# Altium project BIN_DETECTOR_V2.PrjPcb
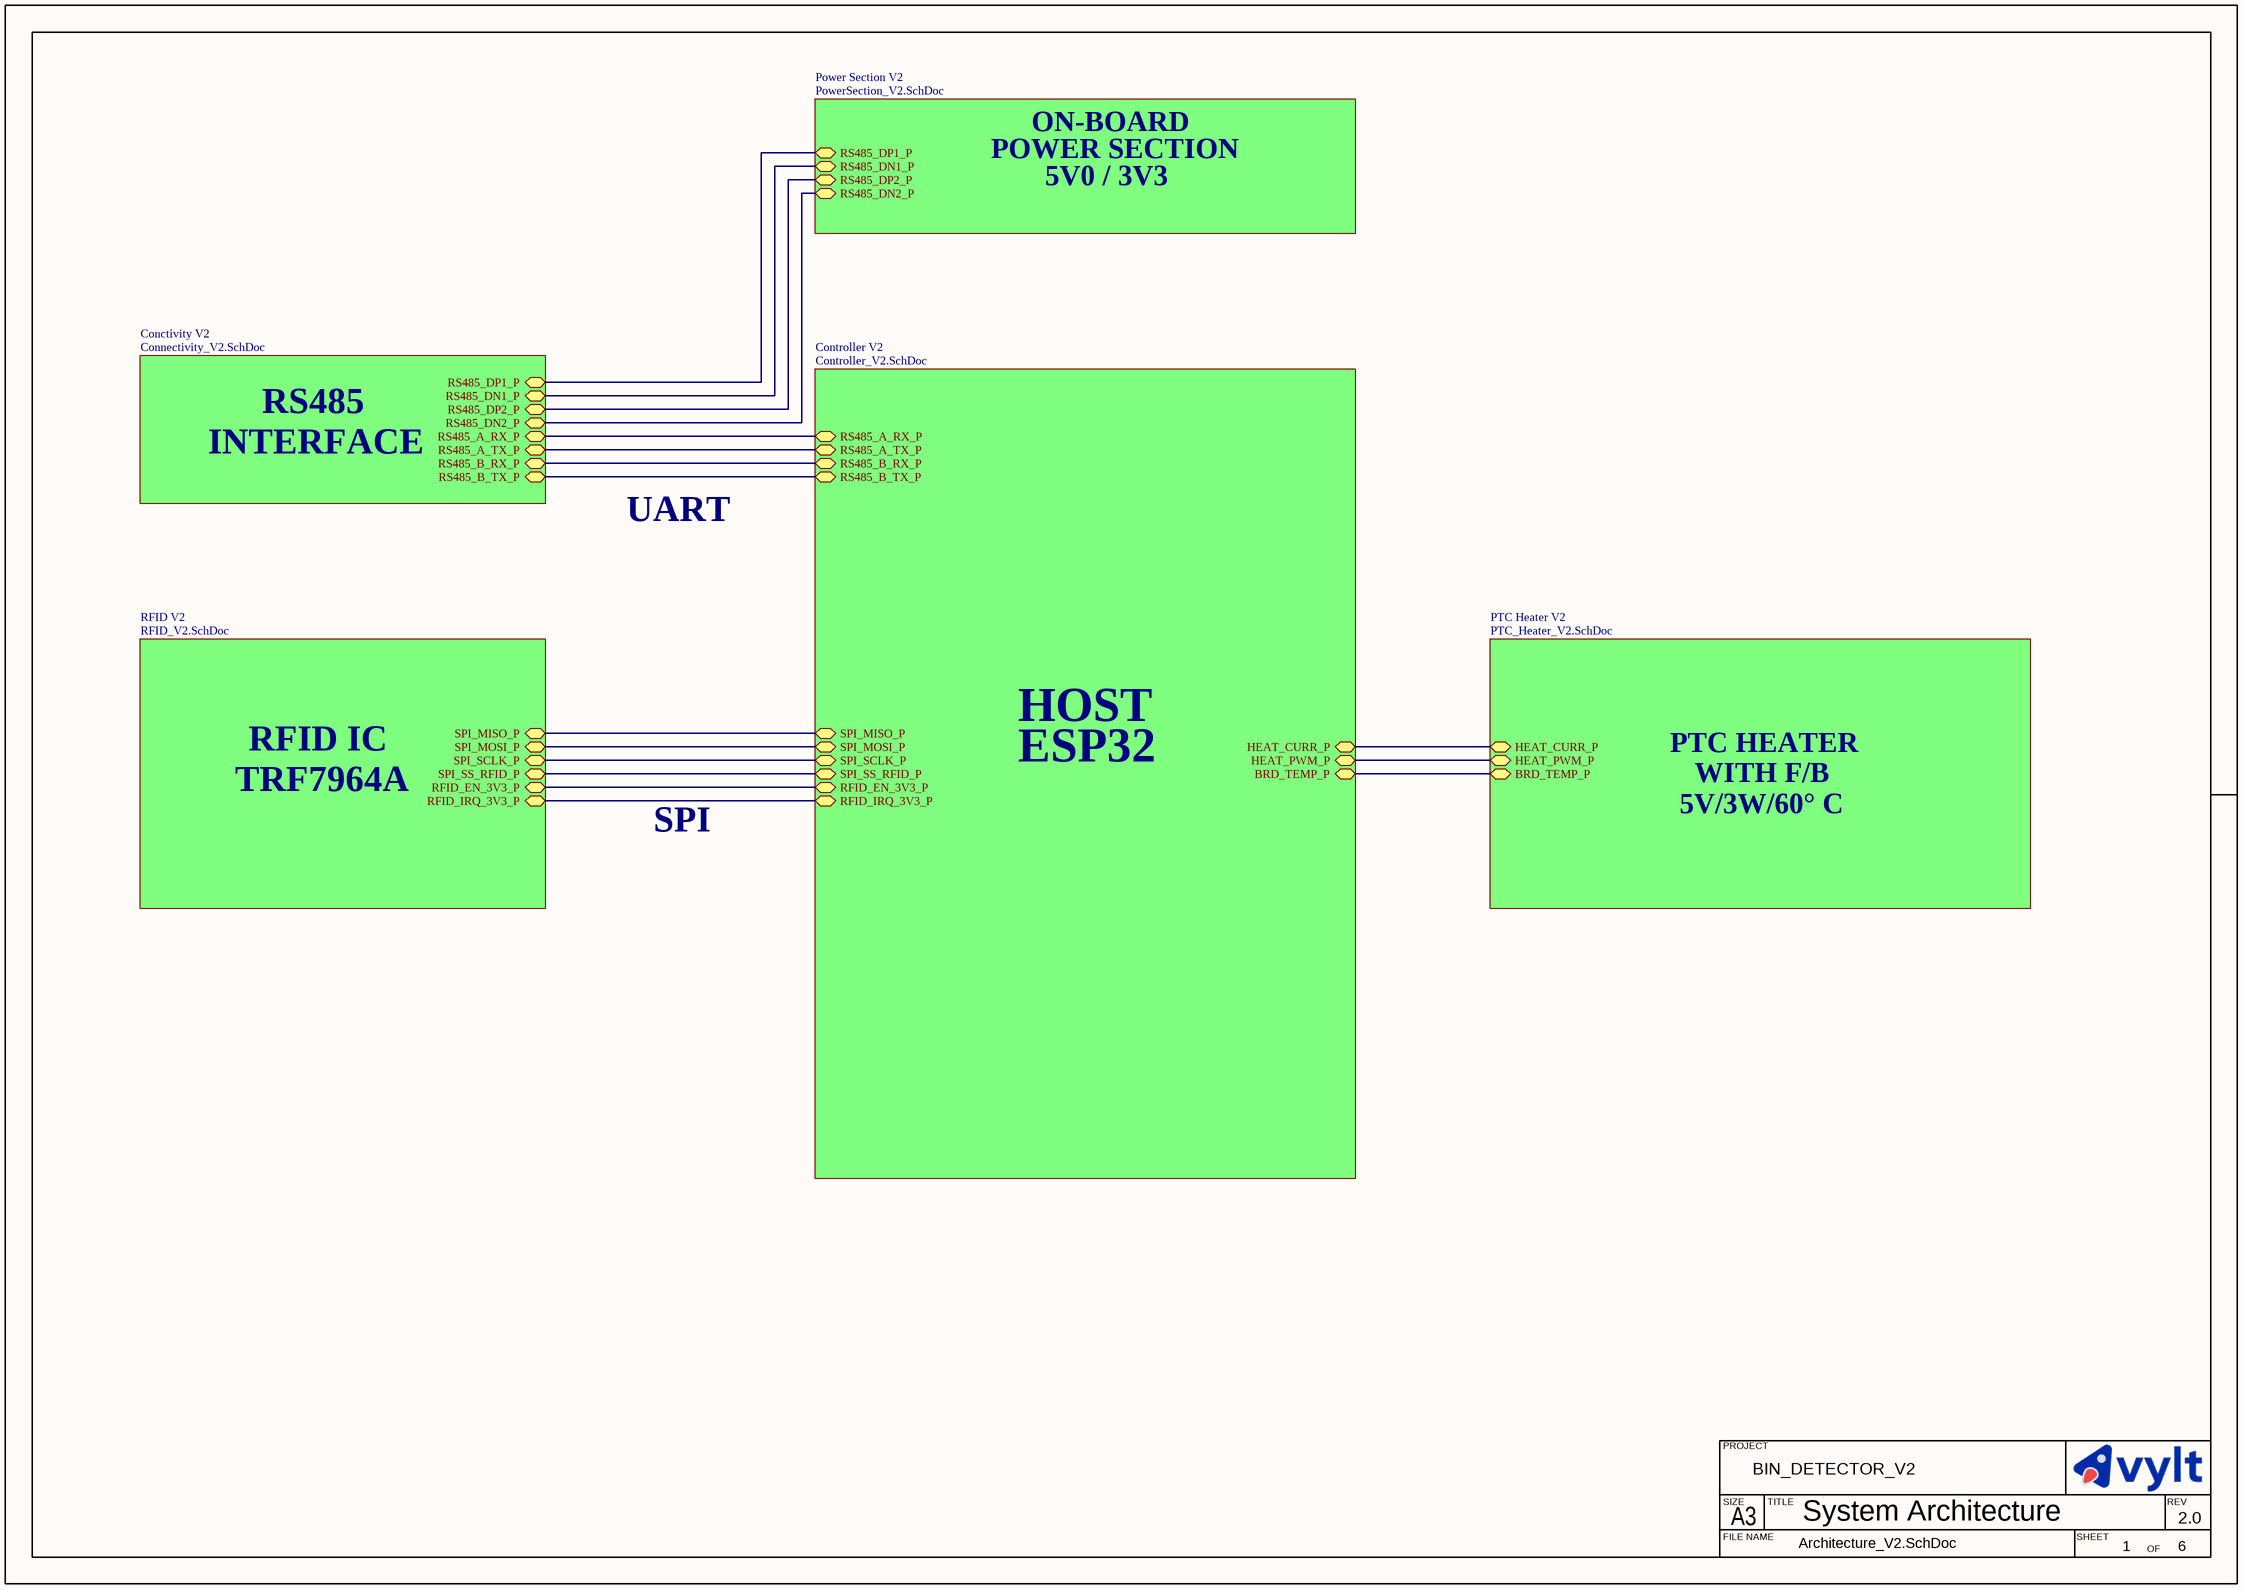
[diagram p0: Architecture_V2.SchDoc]
Revision: 2.0; Project: BIN_DETECTOR_V2
6 sheets, 119 parts. Net scope: hierarchical (ports join the sheet entries above them; power ports are global).
Board file: BIN_DETECTOR_V2.PcbDoc
Sheets:
  Architecture_V2.SchDoc
    RFID V2 = RFID_V2.SchDoc
    Controller V2 = Controller_V2.SchDoc
    Conctivity V2 = Connectivity_V2.SchDoc
    Power Section V2 = PowerSection_V2.SchDoc
    PTC Heater V2 = PTC_Heater_V2.SchDoc

## Sheet Architecture_V2.SchDoc: System Architecture
size 420 x 297 mm; SheetNumber: 1; SheetTotal: 6; DOC_NO_SCH_DWG: 1

### Sub-sheets
Conctivity V2 = Connectivity_V2.SchDoc: RS485_A_TX_P (bidir), RS485_A_RX_P (bidir), RS485_DP1_P (bidir), RS485_DN1_P (bidir), RS485_B_TX_P (bidir), RS485_B_RX_P (bidir), RS485_DP2_P (bidir), RS485_DN2_P (bidir)
Controller V2 = Controller_V2.SchDoc: SPI_MOSI_P (bidir), SPI_SCLK_P (bidir), SPI_SS_RFID_P (bidir), RFID_EN_3V3_P (bidir), RFID_IRQ_3V3_P (bidir), RS485_A_TX_P (bidir), RS485_A_RX_P (bidir), SPI_MISO_P (bidir), HEAT_CURR_P (bidir), BRD_TEMP_P (bidir), HEAT_PWM_P (bidir), RS485_B_TX_P (bidir), RS485_B_RX_P (bidir)
Power Section V2 = PowerSection_V2.SchDoc: RS485_DP1_P (bidir), RS485_DN1_P (bidir), RS485_DP2_P (bidir), RS485_DN2_P (bidir)
PTC Heater V2 = PTC_Heater_V2.SchDoc: HEAT_CURR_P (bidir), BRD_TEMP_P (bidir), HEAT_PWM_P (bidir)
RFID V2 = RFID_V2.SchDoc: SPI_MISO_P (bidir), SPI_MOSI_P (bidir), SPI_SCLK_P (bidir), SPI_SS_RFID_P (bidir), RFID_EN_3V3_P (bidir), RFID_IRQ_3V3_P (bidir)

### Nets
BRD_TEMP: sheet Controller V2/BRD_TEMP_P, sheet PTC Heater V2/BRD_TEMP_P
HEAT_CURR: sheet Controller V2/HEAT_CURR_P, sheet PTC Heater V2/HEAT_CURR_P
HEAT_PWM: sheet Controller V2/HEAT_PWM_P, sheet PTC Heater V2/HEAT_PWM_P
RFID_3V3_EN: sheet RFID V2/RFID_EN_3V3_P, sheet Controller V2/RFID_EN_3V3_P
RFID_3V3_IRQ: sheet RFID V2/RFID_IRQ_3V3_P, sheet Controller V2/RFID_IRQ_3V3_P
RFID_MISO: sheet RFID V2/SPI_MISO_P, sheet Controller V2/SPI_MISO_P
RFID_MOSI: sheet RFID V2/SPI_MOSI_P, sheet Controller V2/SPI_MOSI_P
RFID_SCLK: sheet RFID V2/SPI_SCLK_P, sheet Controller V2/SPI_SCLK_P
RFID_SS: sheet RFID V2/SPI_SS_RFID_P, sheet Controller V2/SPI_SS_RFID_P
RS485_A_RX: sheet Controller V2/RS485_A_RX_P, sheet Conctivity V2/RS485_A_RX_P
RS485_A_TX: sheet Controller V2/RS485_A_TX_P, sheet Conctivity V2/RS485_A_TX_P
RS485_B_RX: sheet Controller V2/RS485_B_RX_P, sheet Conctivity V2/RS485_B_RX_P
RS485_B_TX: sheet Controller V2/RS485_B_TX_P, sheet Conctivity V2/RS485_B_TX_P
RS485_L1_N: sheet Conctivity V2/RS485_DN1_P, sheet Power Section V2/RS485_DN1_P
RS485_L1_P: sheet Conctivity V2/RS485_DP1_P, sheet Power Section V2/RS485_DP1_P
RS485_L2_N: sheet Conctivity V2/RS485_DN2_P, sheet Power Section V2/RS485_DN2_P
RS485_L2_P: sheet Conctivity V2/RS485_DP2_P, sheet Power Section V2/RS485_DP2_P

### Notes on the sheet
- POWER SECTION
- ON-BOARD
- 5V0 / 3V3
- INTERFACE
- RS485
- UART
- HOST
- TRF7964A
- RFID IC
- ESP32
- PTC HEATER
- WITH F/B
- SPI
- 5V/3W/60° C
- PROJECT
- SIZE
- FILE NAME
- A3
- TITLE
- SHEET
- OF
- REV

## Sheet RFID_V2.SchDoc: RFID IC
size 420 x 297 mm; SheetNumber: 2; SheetTotal: 3
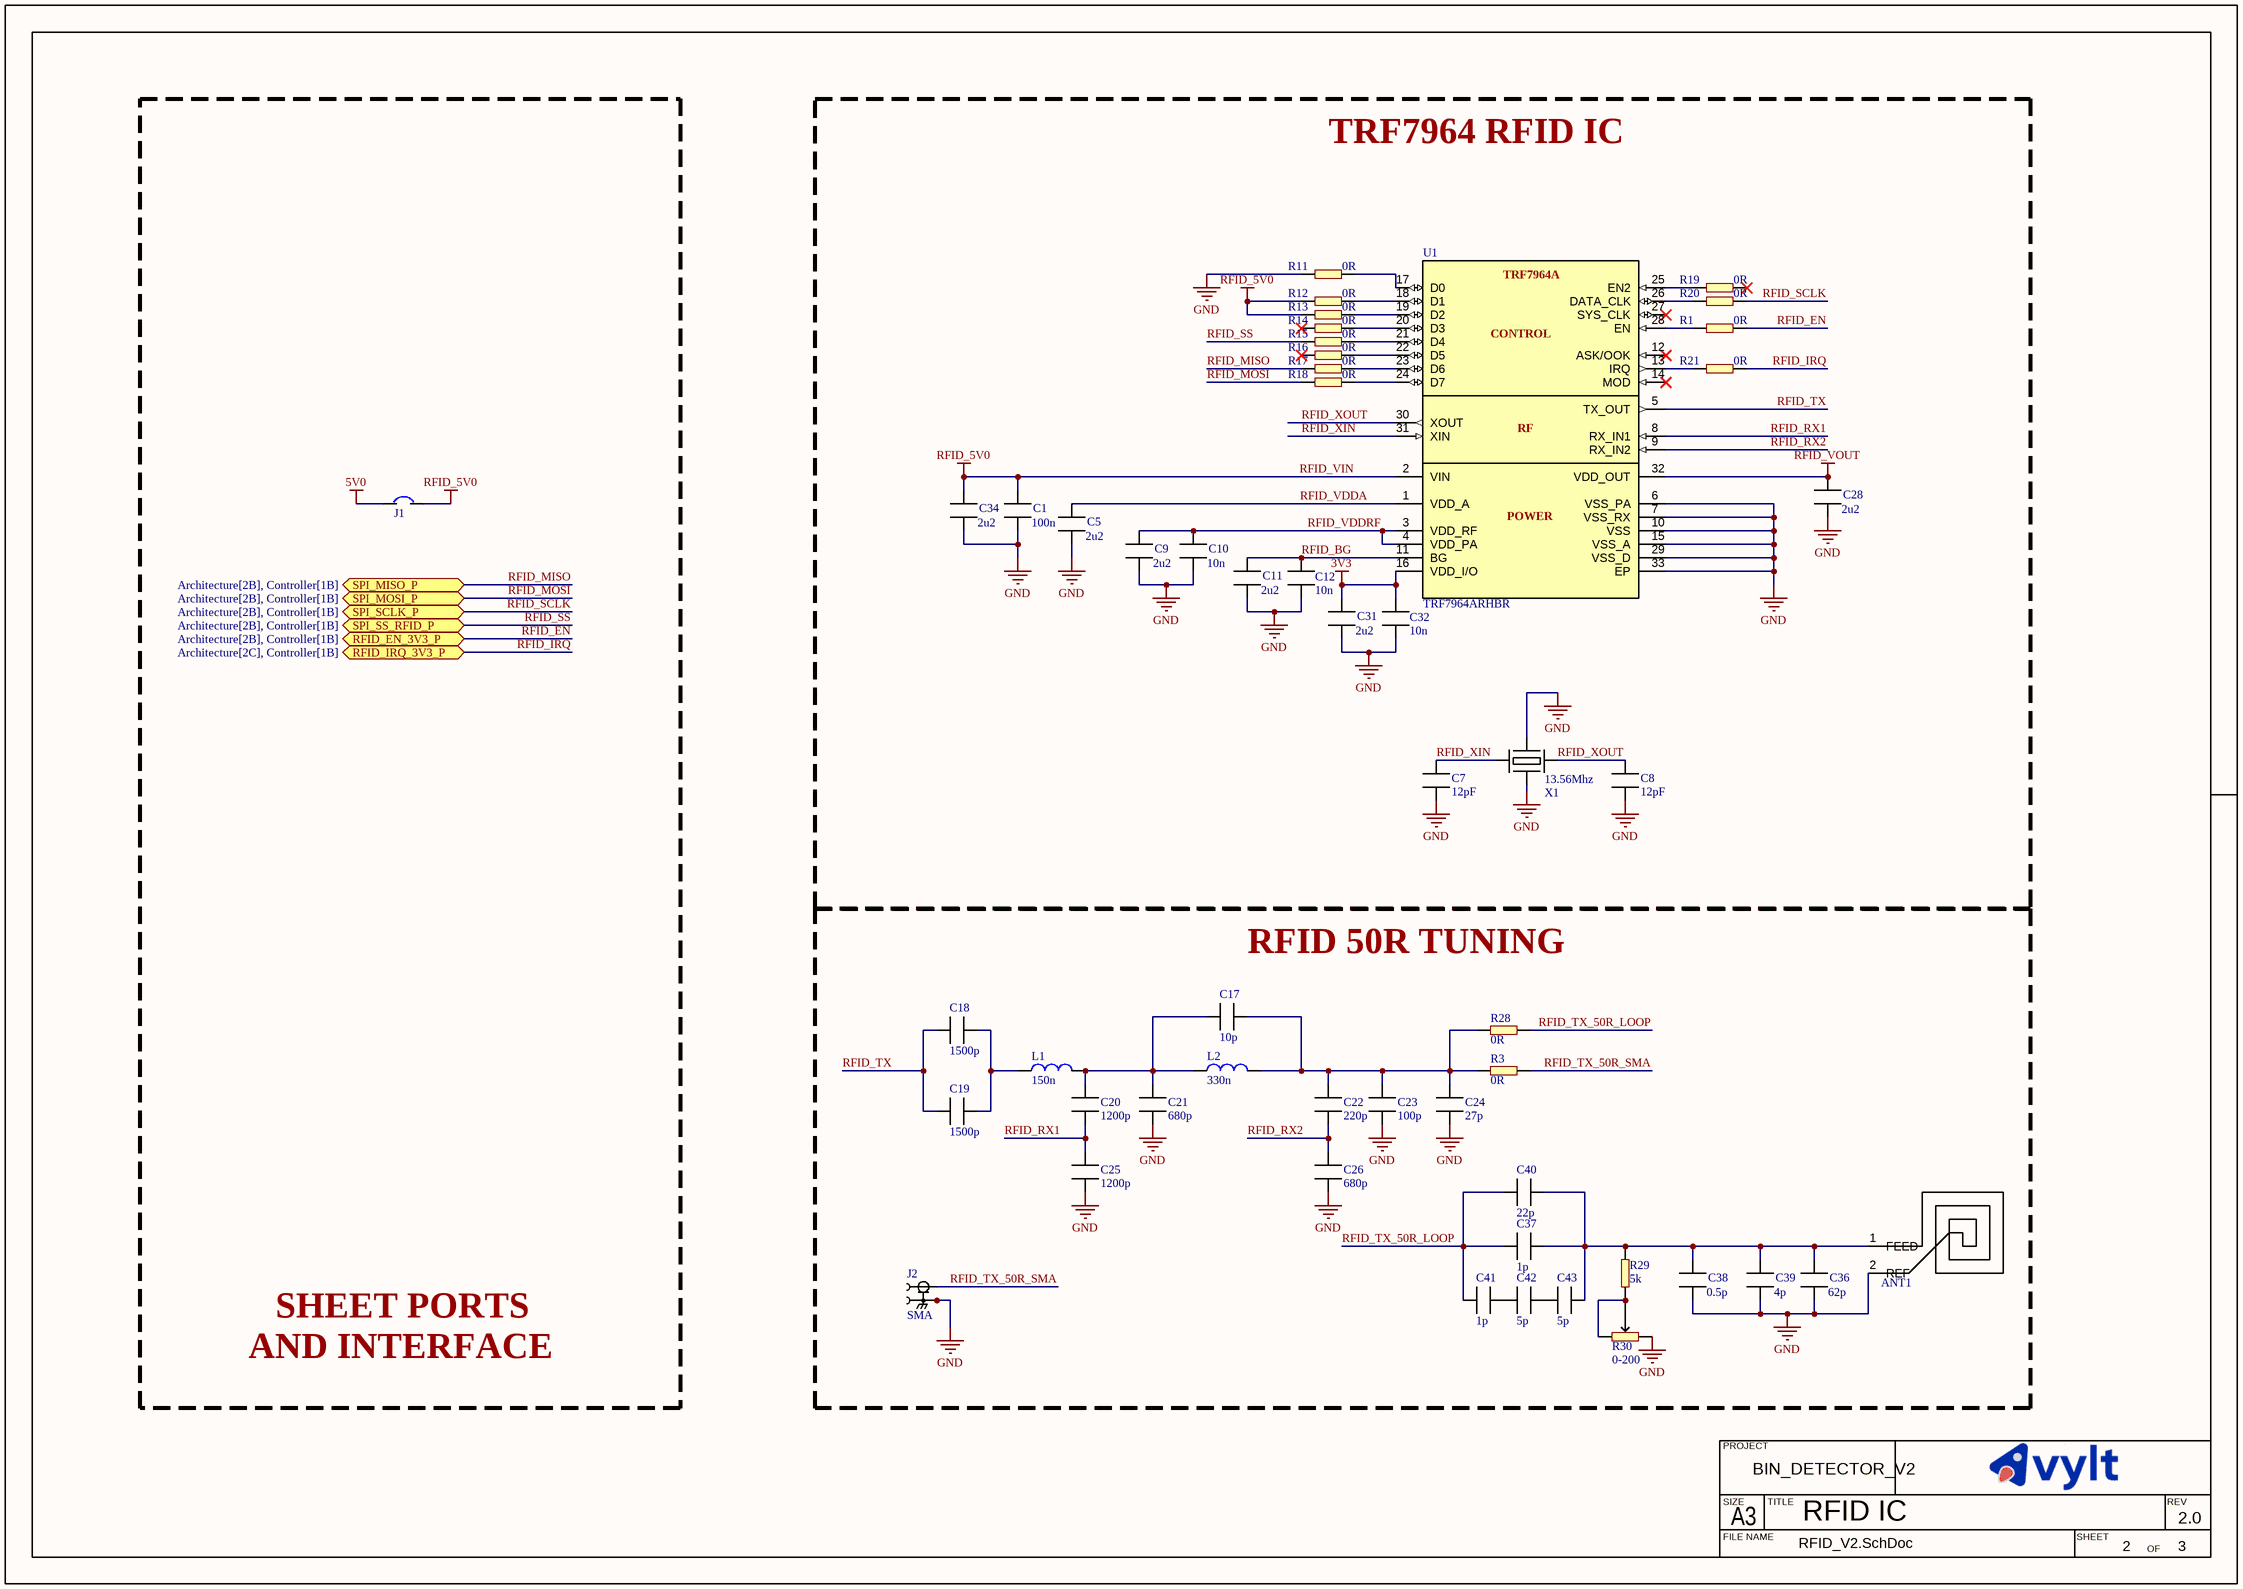
[diagram p1: RFID_V2.SchDoc]

### Parts
ANT1  LOOP_ANT_1.51uH  [LOOP_ANT_1.51uH]  (value not drawn)  (no BOM)
C1  value 100n  [CAPC1608X10N]  (hidden comment: ERP_102-1)
C5  value 2u2  [CAPC1608X10N]  (hidden comment: ERP_102-1)
C7  value 12pF  [CAPC1608X10N]  (hidden comment: ERP_102-1)
C8  value 12pF  [CAPC1608X10N]  (hidden comment: ERP_102-1)
C9  value 2u2  [CAPC1608X10N]  (hidden comment: ERP_102-1)
C10  value 10n  [CAPC1608X10N]  (hidden comment: ERP_102-1)
C11  value 2u2  [CAPC1608X10N]  (hidden comment: ERP_102-1)
C12  value 10n  [CAPC1608X10N]  (hidden comment: ERP_102-1)
C17  value 10p  [CAPC1608X10N]  (hidden comment: ERP_102-1)
C18  value 1500p  [CAPC1608X10N]  (hidden comment: ERP_102-1)
C19  value 1500p  [CAPC1608X10N]  (hidden comment: ERP_102-1)
C20  value 1200p  [CAPC1608X10N]  (hidden comment: ERP_102-1)
C21  value 680p  [CAPC1608X10N]  (hidden comment: ERP_102-1)
C22  value 220p  [CAPC1608X10N]  (hidden comment: ERP_102-1)
C23  value 100p  [CAPC1608X10N]  (hidden comment: ERP_102-1)
C24  value 27p  [CAPC1608X10N]  (hidden comment: ERP_102-1)
C25  value 1200p  [CAPC1608X10N]  (hidden comment: ERP_102-1)
C26  value 680p  [CAPC1608X10N]  (hidden comment: ERP_102-1)
C28  value 2u2  [CAPC1608X10N]  (hidden comment: ERP_102-1)
C31  value 2u2  [CAPC1608X10N]  (hidden comment: ERP_102-1)
C32  value 10n  [CAPC1608X10N]  (hidden comment: ERP_102-1)
C34  value 2u2  [CAPC1608X10N]  (hidden comment: ERP_102-1)
C36  value 62p  [CAPC1608X10N]  (hidden comment: ERP_102-1)
C37  value 1p  [CAPC1608X10N]  (hidden comment: ERP_102-1)
C38  value 0.5p  [CAPC1608X10N]  (hidden comment: ERP_102-1)
C39  value 4p  [CAPC1608X10N]  (hidden comment: ERP_102-1)
C40  value 22p  [CAPC1608X10N]  (hidden comment: ERP_102-1)
C41  value 1p  [CAPC1608X10N]  (hidden comment: ERP_102-1)
C42  value 5p  [CAPC1608X10N]  (hidden comment: ERP_102-1)
C43  value 5p  [CAPC1608X10N]  (hidden comment: ERP_102-1)
J1  Jumper_2P  [Jumper_2P]  (value not drawn)  (no BOM)
J2  value SMA  [SMA_TopEntry_50R]  (hidden comment: SMA_TopEntry_50R)
L1  value 150n  [IND_1008]  (hidden comment: ERP_103-3)
L2  value 330n  [IND_1008]  (hidden comment: ERP_103-3)
R1  value 0R  [RES_0603]  (hidden comment: ERP_101-1)
R3  value 0R  [RES_0603]  (hidden comment: ERP_101-1)
R11  value 0R  [RES_0603]  (hidden comment: ERP_101-1)
R12  value 0R  [RES_0603]  (hidden comment: ERP_101-1)
R13  value 0R  [RES_0603]  (hidden comment: ERP_101-1)
R14  value 0R  [RES_0603]  (hidden comment: ERP_101-1)
R15  value 0R  [RES_0603]  (hidden comment: ERP_101-1)
R16  value 0R  [RES_0603]  (hidden comment: ERP_101-1)
R17  value 0R  [RES_0603]  (hidden comment: ERP_101-1)
R18  value 0R  [RES_0603]  (hidden comment: ERP_101-1)
R19  value 0R  [RES_0603]  (hidden comment: ERP_101-1)
R20  value 0R  [RES_0603]  (hidden comment: ERP_101-1)
R21  value 0R  [RES_0603]  (hidden comment: ERP_101-1)
R28  value 0R  [RES_0603]  (hidden comment: ERP_101-1)
R29  value 5k  [RES_0603]  (hidden comment: ERP_101-1)
R30  value 0-200  [RES_VAR_3361P]  (hidden comment: ERP_101-1)
U1  value TRF7964ARHBR  [RHB32_3P45X3P45_TEX]  (hidden comment: ERP_121-4)
X1  value 13.56Mhz  [CRYS_L3.2_W2.5]  (hidden comment: ERP_111-1)

### Blocks framed on the sheet
TRF7964 RFID IC: C1 C5 C7-C12 C28 C31 C32 C34 R1 R11-R21 U1 X1
RFID 50R TUNING: ANT1 C17-C26 C36-C43 J2 L1 L2 R3 R28-R30

### Ports
RFID_EN_3V3_P (bidir, see Architecture[2B], Controller[1B]), RFID_IRQ_3V3_P (bidir, see Architecture[2C], Controller[1B]), SPI_MISO_P (bidir, see Architecture[2B], Controller[1B]), SPI_MOSI_P (bidir, see Architecture[2B], Controller[1B]), SPI_SCLK_P (bidir, see Architecture[2B], Controller[1B]), SPI_SS_RFID_P (bidir, see Architecture[2B], Controller[1B])

### Nets
3V3: C31.1 C32.1 U1.16(VDD_I/O)
5V0: J1.1  [project net HEAT_VSEN_P]
GND: ANT1.2(REF) C1.2 C5.2 C7.2 C8.2 C9.2 C10.2 C11.2 C12.2 C21.1 C23.1 C24.1 C25.1 C26.1 C28.2 C31.2 C32.2 C34.2 C36.2 C38.2 C39.2 J2.2 J2.3 J2.4 J2.5 R11.2 R30.1 U1.6(VSS_PA) U1.7(VSS_RX) U1.10(VSS) U1.15(VSS_A) U1.29(VSS_D) U1.33(EP) X1.2 X1.4
RFID_VIN: C1.1 C34.1 J1.2 R12.2 R13.2 U1.2(VIN)  [also labelled RFID_5V0]
RFID_VOUT: C28.1 U1.32(VDD_OUT)
RFID_BG: C11.1 C12.1 U1.11(BG)
RFID_EN: R1.1 ; port RFID_EN_3V3_P  [project net RFID_3V3_EN]
RFID_IRQ: R21.1 ; port RFID_IRQ_3V3_P  [project net RFID_3V3_IRQ]
RFID_MISO: R17.2 ; port SPI_MISO_P
RFID_MOSI: R18.2 ; port SPI_MOSI_P
RFID_RX1: C20.1 C25.2 U1.8(RX_IN1)
RFID_RX2: C22.1 C26.2 U1.9(RX_IN2)
RFID_SCLK: R20.1 ; port SPI_SCLK_P
RFID_SS: R15.2 ; port SPI_SS_RFID_P
RFID_TX: C18.1 C19.1 U1.5(TX_OUT)
RFID_TX_50R_LOOP: C37.1 C40.1 C41.1 R28.1
RFID_TX_50R_SMA: J2.1 R3.1
RFID_VDDA: C5.1 U1.1(VDD_A)
RFID_VDDRF: C9.1 C10.1 U1.3(VDD_RF) U1.4(VDD_PA)
RFID_XIN: C7.1 U1.31(XIN) X1.1
RFID_XOUT: C8.1 U1.30(XOUT) X1.3
NetANT1_1: ANT1.1(FEED) C36.1 C37.2 C38.1 C39.1 C40.2 C43.2 R29.2
NetC17_1: C17.1 C22.2 C23.2 C24.2 L2.2 R3.2 R28.2
NetC17_2: C17.2 C20.2 C21.2 L1.2 L2.1
NetC18_2: C18.2 C19.2 L1.1
NetC41_2: C41.2 C42.1
NetC42_2: C42.2 C43.1
NetR1_2: R1.2 U1.28(EN)
NetR11_1: R11.1 U1.17(D0)
NetR12_1: R12.1 U1.18(D1)
NetR13_1: R13.1 U1.19(D2)
NetR14_1: R14.1 U1.20(D3)
NetR15_1: R15.1 U1.21(D4)
NetR16_1: R16.1 U1.22(D5)
NetR17_1: R17.1 U1.23(D6)
NetR18_1: R18.1 U1.24(D7)
NetR19_2: R19.2 U1.25(EN2)
NetR20_2: R20.2 U1.26(DATA_CLK)
NetR21_2: R21.2 U1.13(IRQ)
NetR29_1: R29.1 R30.2 R30.3

Not connected (* = marked no-connect by the designer): R14 2*; R16 2*; R19 1*; U1 12(ASK/OOK)* 14(MOD)* 27(SYS_CLK)*

### Notes on the sheet
- SHEET PORTS
- AND INTERFACE
- PROJECT
- SIZE
- FILE NAME
- A3
- TITLE
- SHEET
- OF
- REV
- (in symbol TRF7964A) CONTROL; RF; POWER

### Library data of the parts
ANT1 = LOOP_ANT_1.51uH: LOOP_ANT_1.51uH_4t_40L_45W_0.4W_0.8P
C1 = MLCC_0603: MLCC 0603; Manufacturer 1: Murata; Manufacturer Part Number 1: CC0603JRX7R9BB104; Package: 0603; Supplier 1: *; Suuplier Part Number 1: *; ERP: *
C5 C9 C11 C28 C31 C34 = MLCC_0603: MLCC 0603; Manufacturer 1: Murata Electronics; Manufacturer Part Number 1: GRT188R61H225KE13D; Package: 0603; Suuplier Part Number 1: *; ERP: *; Supplier 1: Digikey; Supplier Part Number 1: 490-12332-1-ND
C7 C8 = MLCC_0603: MLCC 0603; Manufacturer 1: Yageo; Manufacturer Part Number 1: CC0603JPNPO9BN120; Package: 0603; Suuplier Part Number 1: *; ERP: *; Supplier 1: Digikey; Supplier Part Number 1: 13-CC0603JPNPO9BN120CT-ND
C10 C12 C32 = MLCC_0603: MLCC 0603; Manufacturer 1: Murata; Manufacturer Part Number 1: GRM1885C1H103JA01D; Package: 0603; Suuplier Part Number 1: *; ERP: *; Supplier 1: Digikey; Supplier Part Number 1: 490-9666-1-ND
C17 = MLCC_0603: MLCC 0603; Manufacturer 1: Yageo; Manufacturer Part Number 1: CC0603FRNPO9BN100; Package: 0603; Suuplier Part Number 1: *; ERP: *; Supplier 1: Digikey; Supplier Part Number 1: 311-3349-1-ND
C18 C19 = MLCC_0603: MLCC 0603; Manufacturer 1: Murata; Manufacturer Part Number 1: GRM1885C1H152FA01D; Package: 0603; Suuplier Part Number 1: *; ERP: *; Supplier 1: Digikey; Supplier Part Number 1: 490-11446-1-ND
C20 C25 = MLCC_0603: MLCC 0603; Manufacturer 1: Murata; Manufacturer Part Number 1: GCM1885C1H122FA16D; Package: 0603; Suuplier Part Number 1: *; ERP: *; Supplier 1: Digikey; Supplier Part Number 1: 490-GCM1885C1H122FA16DCT-ND
C21 C26 = MLCC_0603: MLCC 0603; Manufacturer 1: Yageo; Manufacturer Part Number 1: CC0603FRNPO9BN681; Package: 0603; Suuplier Part Number 1: *; ERP: *; Supplier 1: Digikey; Supplier Part Number 1: 311-3905-1-ND
C22 = MLCC_0603: MLCC 0603; Manufacturer 1: Yageo; Manufacturer Part Number 1: CC0603FRNPO9BN221; Package: 0603; Suuplier Part Number 1: *; ERP: *; Supplier 1: Digikey; Supplier Part Number 1: 311-3891-1-ND
C23 = MLCC_0603: MLCC 0603; Manufacturer 1: Yageo; Manufacturer Part Number 1: CC0603FRNPO9BN101; Package: 0603; Suuplier Part Number 1: *; ERP: *; Supplier 1: Digikey; Supplier Part Number 1: 311-3599-1-ND
C24 = MLCC_0603: MLCC 0603; Manufacturer 1: Yageo; Manufacturer Part Number 1: CC0603FRNPO9BN270; Package: 0603; Suuplier Part Number 1: *; ERP: *; Supplier 1: Digikey; Supplier Part Number 1: 311-3892-1-ND
C36 = MLCC_0603: Chip Capacitor, 2-Leads, Body 1.60x0.80mm, IPC Medium Density; Manufacturer 1: KEMET; Manufacturer Part Number 1: CBR06C620F5GAC; Package: 0603; Suuplier Part Number 1: *; ERP: *
C37 C41 = MLCC_0603: Chip Capacitor, 2-Leads, Body 1.60x0.80mm, IPC Medium Density; Manufacturer 1: KEMET; Manufacturer Part Number 1: CBR06C109B5GAC; Package: 0603; Suuplier Part Number 1: *; ERP: *; Supplier 1: Digikey; Supplier Part Number 1: 399-CBR06C109B5GACCT-ND
C38 = MLCC_0603: Chip Capacitor, 2-Leads, Body 1.60x0.80mm, IPC Medium Density; Manufacturer 1: KEMET; Manufacturer Part Number 1: CBR06C508B5GAC; Package: 0603; Suuplier Part Number 1: *; ERP: *; Supplier 1: Digikey; Supplier Part Number 1: 399-13249-1-ND
C39 = MLCC_0603: Chip Capacitor, 2-Leads, Body 1.60x0.80mm, IPC Medium Density; Manufacturer 1: KEMET; Manufacturer Part Number 1: CBR06C409B5GAC; Package: 0603; Suuplier Part Number 1: *; ERP: *; Supplier 1: Digikey; Supplier Part Number 1: 399-CBR06C409B5GACCT-ND
C40 = MLCC_0603: Chip Capacitor, 2-Leads, Body 1.60x0.80mm, IPC Medium Density; Manufacturer 1: KEMET; Manufacturer Part Number 1: CBR06C220J5GACAUTO; Package: 0603; Suuplier Part Number 1: *; ERP: *; Supplier 1: Digikey; Supplier Part Number 1: 399-CBR06C220J5GACAUTOCT-ND
C42 C43 = MLCC_0603: Chip Capacitor, 2-Leads, Body 1.60x0.80mm, IPC Medium Density; Manufacturer 1: KEMET; Manufacturer Part Number 1: CBR06C509A5GAC; Package: 0603; Suuplier Part Number 1: *; ERP: *; Supplier 1: Digikey; Supplier Part Number 1: 399-17323-1-ND
J1 = Jumper_2P: Jumper 2 Pins
J2 = SMA_TopEntry_50R: SMA STR PCB SKT GZD; Manufacturer Part Number 1: 5-1814832-2; Manufacturer 1: TE; Supplier Part Number 1: *; Supplier 1: Digikey; ERP: *; Package: SMA
L1 = IND_1008: Manufacturer Part Number 1: LQW2UASR15F00L; Manufacturer 1: Murata Electronics; ERP: *; Suuplier Part Number 1: *; Package: 1008; Supplier 1: Digikey; Supplier Part Number 1: 490-16089-1-ND
L2 = IND_1008: Manufacturer Part Number 1: LQW2UASR33F00L; Manufacturer 1: Murata Electronics; ERP: *; Suuplier Part Number 1: *; Supplier 1: *; Package: 1008
R1 R3 R11-R21 R28 = RES_0603: Manufacturer 1: Yageo; Manufacturer Part Number 1: RC0603JR-070RL; Package: 0603; Suuplier Part Number 1: *; ERP: *; Supplier 1: Digikey; Supplier Part Number 1: 311-0.0GRCT-ND
R29 = RES_0603: Manufacturer 1: YAGEO; Manufacturer Part Number 1: RT0603BRE075KL; Package: 0603; ERP: *; Supplier 1: *; Supplier Part Number 1: *; Supplier 2: Digikey; Supplier Part Number 2: 13-RT0603BRE075KLCT-ND
R30 = RES_VAR_3361P: TRIMMER 200 OHM 0.5W GW TOP ADJ; Manufacturer 1: Bourns Inc.; Manufacturer Part Number 1: 3361P-1-201GLF; Package: L7.0XW6.7; ERP: *; Supplier 1: *; Supplier Part Number 1: *; Supplier 2: Digikey; Supplier Part Number 2: 3361P-201GLFCT-ND
U1 = TRF7964A: IC RFID READER 13.56MHZ 32VQFN; Manufacturer 1: TI; Manufacturer Part Number 1: TRF7964ARHBR; Package: VQFN32; Suuplier Part Number 1: *; ERP: *; Supplier 1: Digikey; Supplier Part Number 1: 296-35671-1-ND
X1 = CRYS_L3.2_W2.5: Manufacturer Part Number 1: ABM8G-13.560MHZ-18-D2Y-T; Manufacturer 1: Abracon LLC; Package: L2W1.6-4; ERP: *; Supplier 1: *; Supplier Part Number 1: *; Supplier 2: Digikey; Supplier Part Number 2: 535-10264-1-ND

## Sheet Controller_V2.SchDoc: Controller Section
size 420 x 297 mm
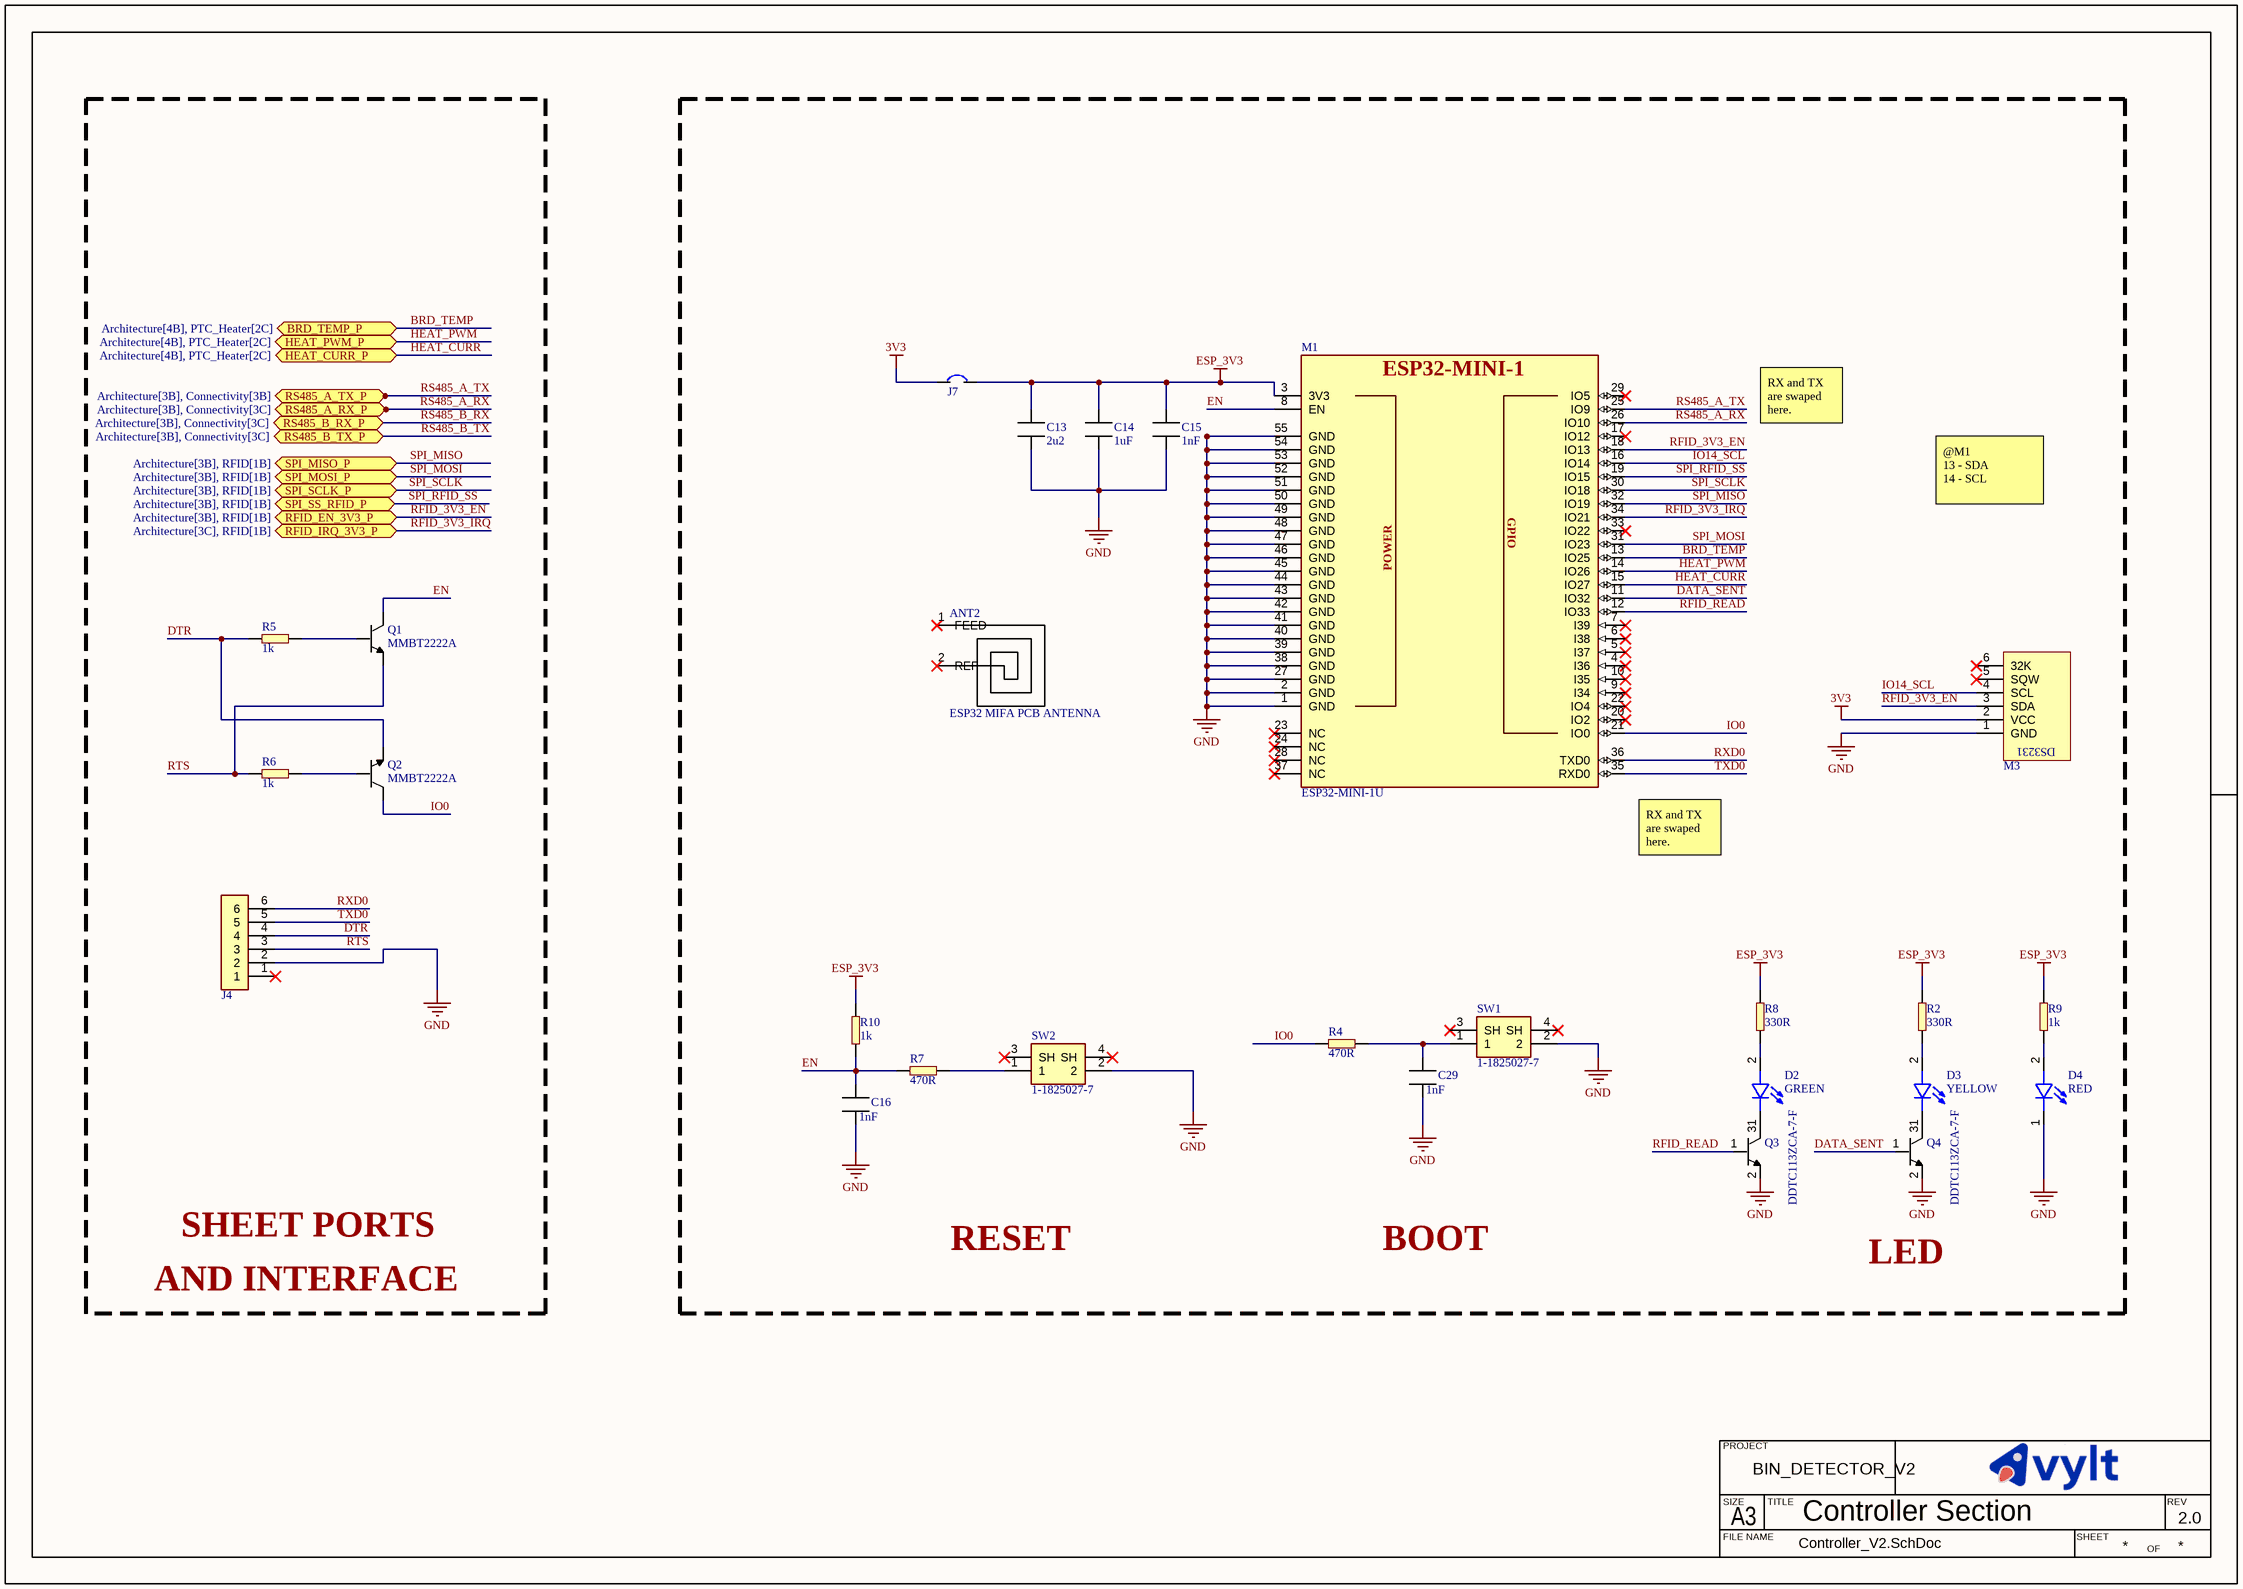
[diagram p2: Controller_V2.SchDoc]

### Parts
ANT2  ESP32 MIFA PCB ANTENNA  [ESP32 MIFA PCB ANTENNA]
C13  value 2u2  [CAPC1608X10N]  (hidden comment: ERP_102-1)
C14  value 1uF  [CAPC1608X10N]  (hidden comment: ERP_102-1)
C15  value 1nF  [CAPC1608X10N]  (hidden comment: ERP_102-1)
C16  value 1nF  [CAPC1608X10N]  (hidden comment: ERP_102-1)
C29  value 1nF  [CAPC1608X10N]  (hidden comment: ERP_102-1)
D2  value GREEN  [LED_2SMD]  (hidden comment: LED_2SMD)
D3  value YELLOW  [LED_2SMD]  (hidden comment: LED_2SMD)
D4  value RED  [LED_2SMD]  (hidden comment: LED_2SMD)
J4  ERP_148-2  [6PX1R]  (value not drawn)  (no BOM)
J7  Jumper_2P  [Jumper_2P]  (value not drawn)  (no BOM)
M1  value ESP32-MINI-1U  [ESP32_MINI_1U]  (hidden comment: ERP_140-3)
M3  DS3231_HW-084  [DS3231_HW-084]  (value not drawn)
Q1  value MMBT2222A  [MMBT2222]  (hidden comment: ERP_105-1)
Q2  value MMBT2222A  [MMBT2222]  (hidden comment: ERP_105-1)
Q3  value DDTC113ZCA-7-F  [DDTCXXXXCA]  (hidden comment: ERP_105-1)
Q4  value DDTC113ZCA-7-F  [DDTCXXXXCA]  (hidden comment: ERP_105-1)
R2  value 330R  [RES_0603]  (hidden comment: ERP_101-1)
R4  value 470R  [RES_0603]  (hidden comment: ERP_101-1)
R5  value 1k  [RES_0603]  (hidden comment: ERP_101-1)
R6  value 1k  [RES_0603]  (hidden comment: ERP_101-1)
R7  value 470R  [RES_0603]  (hidden comment: ERP_101-1)
R8  value 330R  [RES_0603]  (hidden comment: ERP_101-1)
R9  value 1k  [RES_0603]  (hidden comment: ERP_101-1)
R10  value 1k  [RES_0603]  (hidden comment: ERP_101-1)
SW1  value 1-1825027-7  [FSM_6X6]  (hidden comment: ERP_110-4)
SW2  value 1-1825027-7  [FSM_6X6]  (hidden comment: ERP_110-4)

### Ports
BRD_TEMP_P (bidir, see Architecture[4B], PTC_Heater[2C]), HEAT_CURR_P (bidir, see Architecture[4B], PTC_Heater[2C]), HEAT_PWM_P (bidir, see Architecture[4B], PTC_Heater[2C]), RFID_EN_3V3_P (bidir, see Architecture[3B], RFID[1B]), RFID_IRQ_3V3_P (bidir, see Architecture[3C], RFID[1B]), RS485_A_RX_P (bidir, see Architecture[3B], Connectivity[3C]), RS485_A_TX_P (bidir, see Architecture[3B], Connectivity[3B]), RS485_B_RX_P (bidir, see Architecture[3B], Connectivity[3C]), RS485_B_TX_P (bidir, see Architecture[3B], Connectivity[3C]), SPI_MISO_P (bidir, see Architecture[3B], RFID[1B]), SPI_MOSI_P (bidir, see Architecture[3B], RFID[1B]), SPI_SCLK_P (bidir, see Architecture[3B], RFID[1B]), SPI_SS_RFID_P (bidir, see Architecture[3B], RFID[1B])

### Nets
3V3: J7.1 M3.2(VCC)
ESP_3V3: C13.2 C14.2 C15.2 J7.2 M1.3(3V3) R2.2 R8.2 R9.2 R10.2
GND: C13.1 C14.1 C15.1 C16.2 C29.2 D4.1 J4.2 M1.1(GND) M1.2(GND) M1.27(GND) M1.38(GND) M1.39(GND) M1.40(GND) M1.41(GND) M1.42(GND) M1.43(GND) M1.44(GND) M1.45(GND) M1.46(GND) M1.47(GND) M1.48(GND) M1.49(GND) M1.50(GND) M1.51(GND) M1.52(GND) M1.53(GND) M1.54(GND) M1.55(GND) M3.1(GND) Q3.2 Q4.2 SW1.2 SW2.2
BRD_TEMP: M1.13(IO25) ; port BRD_TEMP_P
DATA_SENT: M1.11(IO32) Q4.1
DTR: J4.4 Q2.2 R5.2
EN: C16.1 M1.8(EN) Q1.3 R7.2 R10.1
HEAT_CURR: M1.15(IO27) ; port HEAT_CURR_P
HEAT_PWM: M1.14(IO26) ; port HEAT_PWM_P
IO0: M1.21(IO0) Q2.3 R4.2
IO14_SCL: M1.16(IO14) M3.4(SCL)
RFID_3V3_EN: M1.18(IO13) M3.3(SDA) ; port RFID_EN_3V3_P
RFID_3V3_IRQ: M1.34(IO21) ; port RFID_IRQ_3V3_P
RFID_READ: M1.12(IO33) Q3.1
RS485_A_RX: M1.26(IO10) ; port RS485_A_RX_P
RS485_A_TX: M1.25(IO9) ; port RS485_A_TX_P
RTS: J4.3 Q1.2 R6.2
RXD0: J4.6 M1.36(TXD0)
SPI_MISO: M1.32(IO19) ; port SPI_MISO_P  [project net RFID_MISO]
SPI_MOSI: M1.31(IO23) ; port SPI_MOSI_P  [project net RFID_MOSI]
SPI_RFID_SS: M1.19(IO15) ; port SPI_SS_RFID_P  [project net RFID_SS]
SPI_SCLK: M1.30(IO18) ; port SPI_SCLK_P  [project net RFID_SCLK]
TXD0: J4.5 M1.35(RXD0)
NetC29_1: C29.1 R4.1 SW1.1
NetD2_1: D2.1 Q3.3
NetD2_2: D2.2 R8.1
NetD3_1: D3.1 Q4.3
NetD3_2: D3.2 R2.1
NetD4_2: D4.2 R9.1
NetQ1_1: Q1.1 R5.1
NetQ2_1: Q2.1 R6.1
NetR7_1: R7.1 SW2.1

Not connected (* = marked no-connect by the designer): ANT2 1(FEED)* 2(REF)*; J4 1*; M1 4(I36)* 5(I37)* 6(I38)* 7(I39)* 9(I34)* 10(I35)* 17(IO12)* 20(IO2)* 22(IO4)* 23(NC)* 24(NC)* 28(NC)* 29(IO5)* 33(IO22)* 37(NC)*; M3 5(SQW)* 6(32K)*; SW1 3(SH)* 4(SH)*; SW2 3(SH)* 4(SH)*

### Notes on the sheet
- RX and TX are swaped here.
- @M1
  13 - SDA
  14 - SCL
- (near M1) RX and TX are swaped here.
- SHEET PORTS
- RESET
- BOOT
- LED
- AND INTERFACE
- PROJECT
- SIZE
- FILE NAME
- A3
- TITLE
- SHEET
- OF
- REV
- (in symbol DS3231_HW-084) DS3231
- (in symbol ESP32_MINI_1) ESP32-MINI-1; GPIO; POWER

### Library data of the parts
C13 = MLCC_0603: as C5 on sheet RFID_V2; Package: 0603; Suuplier Part Number 1: *; ERP: *; Supplier 1: Digikey; Supplier Part Number 1: 490-12332-1-ND
C14 = MLCC_0603: MLCC 0603; Manufacturer 1: Samsung Electro-Mechanics; Manufacturer Part Number 1: CL10A105KB8NNNC; Package: 0603; Supplier 1: *; Suuplier Part Number 1: *; ERP: *
C15 C16 C29 = MLCC_0603: MLCC 0603; Manufacturer 1: Samsung Electro-Mechanics; Manufacturer Part Number 1: CL10C102JB8NNNC; Package: 0603; Suuplier Part Number 1: *; ERP: *; Supplier 1: Digikey; Supplier Part Number 1: 1276-1091-1-ND
D2 = LED_2SMD: LED GREEN CLEAR 1204 SMD R/A; Manufacturer Part Number 1: 155124VS73200; Manufacturer 1: Würth Elektronik; ERP: *; Suuplier Part Number 1: *; Supplier 1: Digikey; Package: 1204
D3 = LED_2SMD: LED YELLOW CLEAR 1204 SMD R/A; Manufacturer Part Number 1: 155124YS73200; Manufacturer 1: Würth Elektronik; ERP: *; Suuplier Part Number 1: *; Supplier 1: Digikey; Package: 1204
D4 = LED_2SMD: LED RED CLEAR 1204 SMD R/A; Manufacturer Part Number 1: 155124RS73200; Manufacturer 1: Würth Elektronik; ERP: *; Suuplier Part Number 1: *; Supplier 1: Digikey; Package: 1204
J4 = 6PX1R
J7 = Jumper_2P: Jumper 2 Pins
M1 = ESP32_MINI_1: ESP32_C3_MINI_1 Module; Manufacturer Part Number 1: ESP32-MINI-1U-N4; Manufacturer 1: Espressif Systems; ERP: *; Package: 56 PIN SMD; Supplier 1: Digikey; Supplier Part Number 1: 1965-ESP32-MINI-1U-N4CT-ND
M3 = DS3231_HW-084: DS3231 Time Module , HW-084; Manufacturer 1: Generic; Manufacturer Part Number 1: HW-084(DS3231); Package: 6 Pin TH; ERP: *; Supplier 1: *; Supplier Part Number 1: *; Value: HW-084
Q1 Q2 = MMBT2222: MMBT2222A; Manufacturer Part Number 1: MMBT2222A-7-F; Manufacturer 1: Diotec Semiconductor; ERP: *; Suuplier Part Number 1: *; Supplier 1: *; Package: SOT23
Q3 Q4 = DDTCXXXXCA: TRANS PREBIAS NPN 50V SOT23-3; Manufacturer 1: Diodes Incorporated; ERP: *; Suuplier Part Number 1: *; Supplier 1: Digikey; Manufacturer Part Number 1: DDTC113ZCA-7-F; Package: SOT23
R2 R8 = RES_0603: Manufacturer 1: YAGEO; Manufacturer Part Number 1: RC0603JR-07330RL; Package: 0603; Supplier 1: *; Supplier Part Number 1: *; ERP: *
R4 R7 = RES_0603: Manufacturer 1: YAGEO; Manufacturer Part Number 1: RC0603JR-07470RL; Package: 0603; ERP: *; Supplier 1: *; Supplier Part Number 1: *; Supplier 2: Digikey; Supplier Part Number 2: 311-470GRCT-ND
R5 R6 R9 R10 = RES_0603: Manufacturer 1: YAGEO; Manufacturer Part Number 1: RC0603FR-071KL; Package: 0603; ERP: *; Supplier 1: Digikey; Supplier Part Number 1: 311-1.00KHRCT-ND
SW1 SW2 = FSM_6X6: Manufacturer 1: TE; ERP: *; Suuplier Part Number 1: *; Manufacturer Part Number 1: 1-1825027-7; Package: 6X6; Supplier 1: Digikey; Supplier Part Number 1: 450-1660-ND

## Sheet Connectivity_V2.SchDoc: Connectivity
size 420 x 297 mm
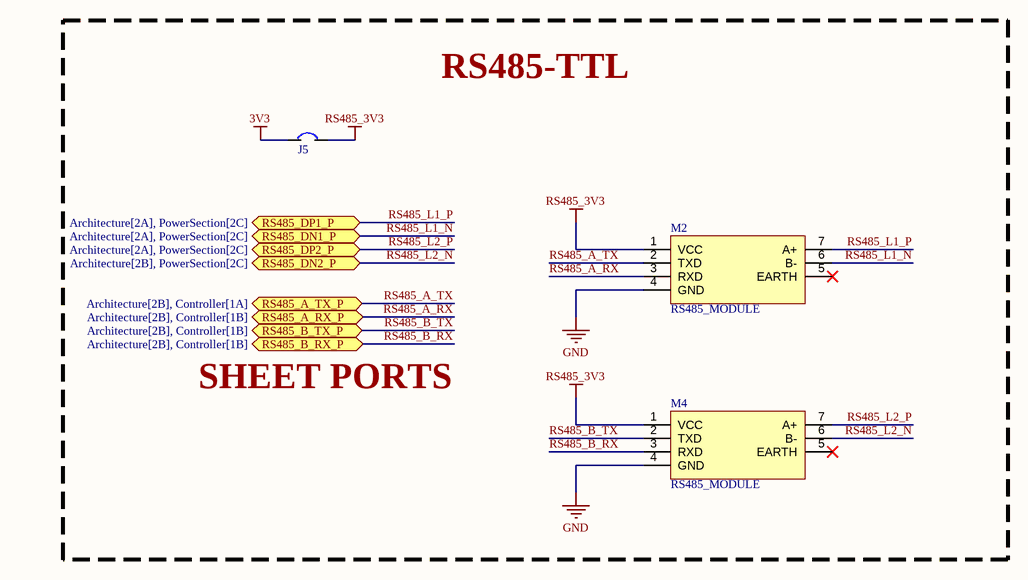
[diagram p3: Connectivity_V2.SchDoc]

### Parts
J5  Jumper_2P  [Jumper_2P]  (value not drawn)  (no BOM)
M2  value RS485_MODULE  [TTL-RS485]  (hidden comment: ERP_140-3)
M4  value RS485_MODULE  [TTL-RS485]  (hidden comment: ERP_140-3)

### Ports
RS485_A_RX_P (bidir, see Architecture[2B], Controller[1B]), RS485_A_TX_P (bidir, see Architecture[2B], Controller[1A]), RS485_B_RX_P (bidir, see Architecture[2B], Controller[1B]), RS485_B_TX_P (bidir, see Architecture[2B], Controller[1B]), RS485_DN1_P (bidir, see Architecture[2A], PowerSection[2C]), RS485_DN2_P (bidir, see Architecture[2B], PowerSection[2C]), RS485_DP1_P (bidir, see Architecture[2A], PowerSection[2C]), RS485_DP2_P (bidir, see Architecture[2A], PowerSection[2C])

### Nets
3V3: J5.1
GND: M2.4(GND) M4.4(GND)
RS485_3V3: J5.2 M2.1(VCC) M4.1(VCC)
RS485_A_RX: M2.3(RXD) ; port RS485_A_RX_P
RS485_A_TX: M2.2(TXD) ; port RS485_A_TX_P
RS485_B_RX: M4.3(RXD) ; port RS485_B_RX_P
RS485_B_TX: M4.2(TXD) ; port RS485_B_TX_P
RS485_L1_N: M2.6(B-) ; port RS485_DN1_P
RS485_L1_P: M2.7(A+) ; port RS485_DP1_P
RS485_L2_N: M4.6(B-) ; port RS485_DN2_P
RS485_L2_P: M4.7(A+) ; port RS485_DP2_P

Not connected (* = marked no-connect by the designer): M2 5(EARTH)*; M4 5(EARTH)*

### Notes on the sheet
- RS485-TTL
- SHEET PORTS
- PROJECT
- SIZE
- FILE NAME
- A3
- TITLE
- SHEET
- OF
- REV

### Library data of the parts
J5 = Jumper_2P: Jumper 2 Pins
M2 M4 = TTL-RS485: Manufacturer 1: Generic; Manufacturer Part Number 1: Generic

## Sheet PowerSection_V2.SchDoc: Power Section
size 420 x 297 mm; SheetNumber: 3; SheetTotal: 3
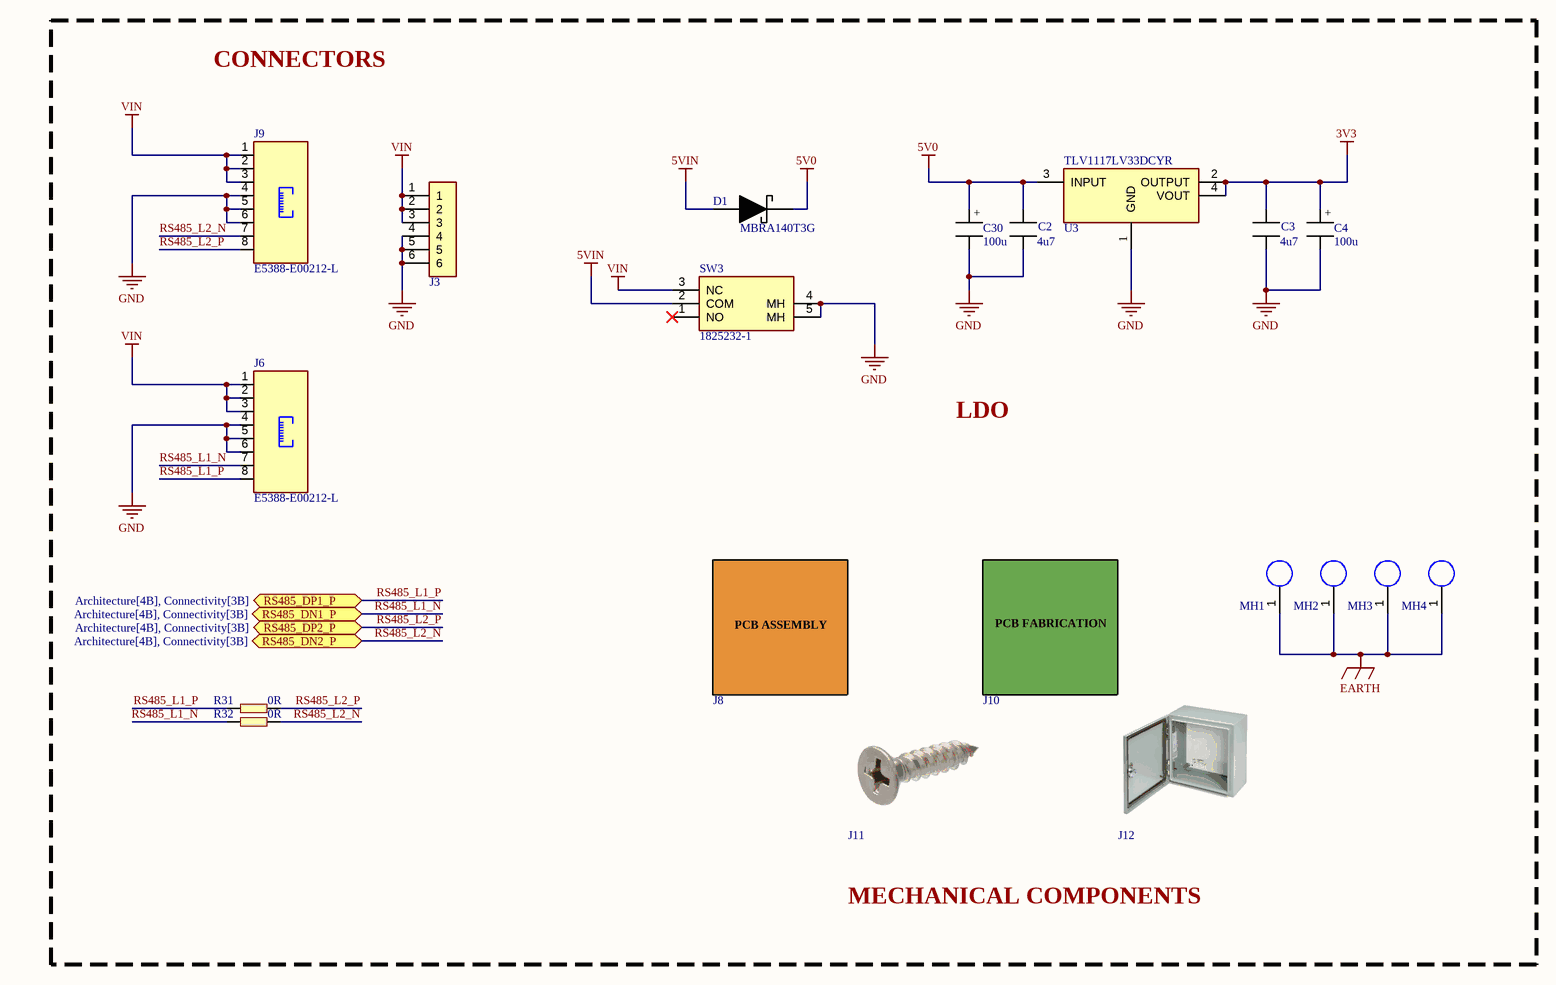
[diagram p4: PowerSection_V2.SchDoc]

### Parts
C2  value 4u7  [CAPC1608X10N]  (hidden comment: ERP_102-1)
C3  value 4u7  [CAPC1608X10N]  (hidden comment: ERP_102-1)
C4  value 100u  [CAP_6.3_7.7]  (hidden comment: ERP_102-2)
C30  value 100u  [CAP_6.3_7.7]  (hidden comment: ERP_102-2)
D1  value MBRA140T3G  [SS14_SMA]  (hidden comment: ERP_104-3)
J3  6Pin_TerminalBlock_5.08P  [6Pin_TerminalBlock_5.08P]  (value not drawn)
J6  value E5388-E00212-L  [RJ45]  (hidden comment: ERP_148-3)
J8  APCB  (value not drawn)
J9  value E5388-E00212-L  [RJ45]  (hidden comment: ERP_148-3)
J10  BPCB  (value not drawn)
J11  SCREW  (value not drawn)
J12  ENCLOSURE  (value not drawn)
MH1  MountingHole4X6  [MountingHole4X6]  (value not drawn)  (graphical)
MH2  MountingHole4X6  [MountingHole4X6]  (value not drawn)  (graphical)
MH3  MountingHole4X6  [MountingHole4X6]  (value not drawn)  (graphical)
MH4  MountingHole4X6  [MountingHole4X6]  (value not drawn)  (graphical)
R31  value 0R  [RES_0603]  (hidden comment: ERP_101-1)
R32  value 0R  [RES_0603]  (hidden comment: ERP_101-1)
SW3  value 1825232-1  [3PIN_SPDT_TH_RA]  (hidden comment: ERP_110-4)
U3  value TLV1117LV33DCYR  [AMS1117_SOT223]  (hidden comment: ERP_123-1)

### Ports
RS485_DN1_P (bidir, see Architecture[4B], Connectivity[3B]), RS485_DN2_P (bidir, see Architecture[4B], Connectivity[3B]), RS485_DP1_P (bidir, see Architecture[4B], Connectivity[3B]), RS485_DP2_P (bidir, see Architecture[4B], Connectivity[3B])

### Nets
3V3: C3.1 C4.1 U3.2(OUTPUT) U3.4(VOUT)
5V0: C2.1 C30.1 D1.1(C) U3.3(INPUT)  [project net HEAT_VSEN_P]
5VIN: D1.2(A) SW3.2(COM)
EARTH: MH1.1 MH2.1 MH3.1 MH4.1
GND: C2.2 C3.2 C4.2 C30.2 J3.4 J3.5 J3.6 J6.4 J6.5 J6.6 J9.4 J9.5 J9.6 SW3.4(MH) SW3.5(MH) U3.1(GND)
VIN: J3.1 J3.2 J3.3 J6.1 J6.2 J6.3 J9.1 J9.2 J9.3 SW3.3(NC)
RS485_L1_N: J6.7 R32.2 ; port RS485_DN1_P
RS485_L1_P: J6.8 R31.2 ; port RS485_DP1_P
RS485_L2_N: J9.7 R32.1 ; port RS485_DN2_P
RS485_L2_P: J9.8 R31.1 ; port RS485_DP2_P

Not connected (* = marked no-connect by the designer): SW3 1(NO)*

### Notes on the sheet
- CONNECTORS
- LDO
- MECHANICAL COMPONENTS
- PROJECT
- SIZE
- FILE NAME
- A3
- TITLE
- SHEET
- OF
- REV
- (in symbol APCB) PCB ASSEMBLY
- (in symbol BPCB) PCB FABRICATION
- (in symbol CAP_6.3_7.7) +

### Library data of the parts
C2 C3 = MLCC_0603: MLCC 0603; Manufacturer 1: Murata; Manufacturer Part Number 1: GRM188R6YA475KE15D; Package: 0603; Suuplier Part Number 1: *; ERP: *; Supplier 1: Digikey; Supplier Part Number 1: 490-7205-1-ND
C4 C30 = CAP_6.3_7.7: Electrolytic Capacitor SMD 6.3x7.7; Manufacturer 1: Nichicon; Manufacturer Part Number 1: UWT1V101MCL1GS; Suuplier Part Number 1: 493-2203-1-ND; Package: 6.3x7.7; ERP: *; Supplier 1: Digikey; Supplier Part Number 1: 493-2203-1-ND
D1 = SS14_SMA: Manufacturer 1: ONSEMi; Supplier Part Number 1: *; Supplier  1: *; Package: SMA; Manufacturer Part Number 1: MBRA140T3G; ERP: *; Supplier 1: Digikey; Supplier Part Number 1: MBRA140T3GOSCT-ND
J3 = 6Pin_TerminalBlock_5.08P: 6PINS TERMINAL BLOCK 5.08 PITCH; Manufacturer Part Number 1: Generic; Value: 6 Pin Screw Terminal; Manufacturer 1: Generic; Supplier Part Number 1: Robu; Supplier 1: 528512; ERP: *; Package: 6PIN
J6 J9 = RJ45: CONN MOD JACK 8P8C R/A UNSHLD; Manufacturer 1: Pulse Electronics; Manufacturer Part Number 1: E5388-E00212-L; ERP: *; Package: 8P8C; Supplier 1: *; Supplier Part Number 1: *; Supplier 2: Digikey; Supplier Part Number 2: 553-E5388-E00212-L-ND
J8 = APCB: Assembled PCB; Value: *; Manufacturer 1: *; Manufacturer Part Number 1: *
J10 = BPCB: Bare PCB; Manufacturer Part Number 1: *; Manufacturer 1: *; Value: *
J11 = SCREW: Mounting Screw
J12 = ENCLOSURE: PCB Enclosure; Manufacturer Part Number 1: *; Manufacturer 1: *; Value: *
R31 R32 = RES_0603: as R1 on sheet RFID_V2; Package: 0603; Suuplier Part Number 1: *; ERP: *; Supplier 1: Digikey; Supplier Part Number 1: 311-0.0GRCT-ND
SW3 = 3PIN_SPDT_TH_RA: Manufacturer 1: TE; ERP: *; Manufacturer Part Number 1: 1825232-1; Package: 6X6; Supplier 1: *; Supplier Part Number 1: *; Supplier 2: Digikey; Supplier Part Number 2: A107673-ND
U3 = AMS1117_SOT223: AMS1117 LDO; Manufacturer 1: TI; Supplier  Part Number 1: *; Supplier  1: *; Package: SOT223; Manufacturer Part Number 1: TLV1117LV33DCYR; ERP: *; Supplier 1: Digikey; Supplier Part Number 1: 296-28778-1-ND

## Sheet PTC_Heater_V2.SchDoc
size 420 x 297 mm; ENG_APP_DATE: --/--/--; DSN_APP_DATE: --/--/--; CHK_APP_DATE: --/--/--
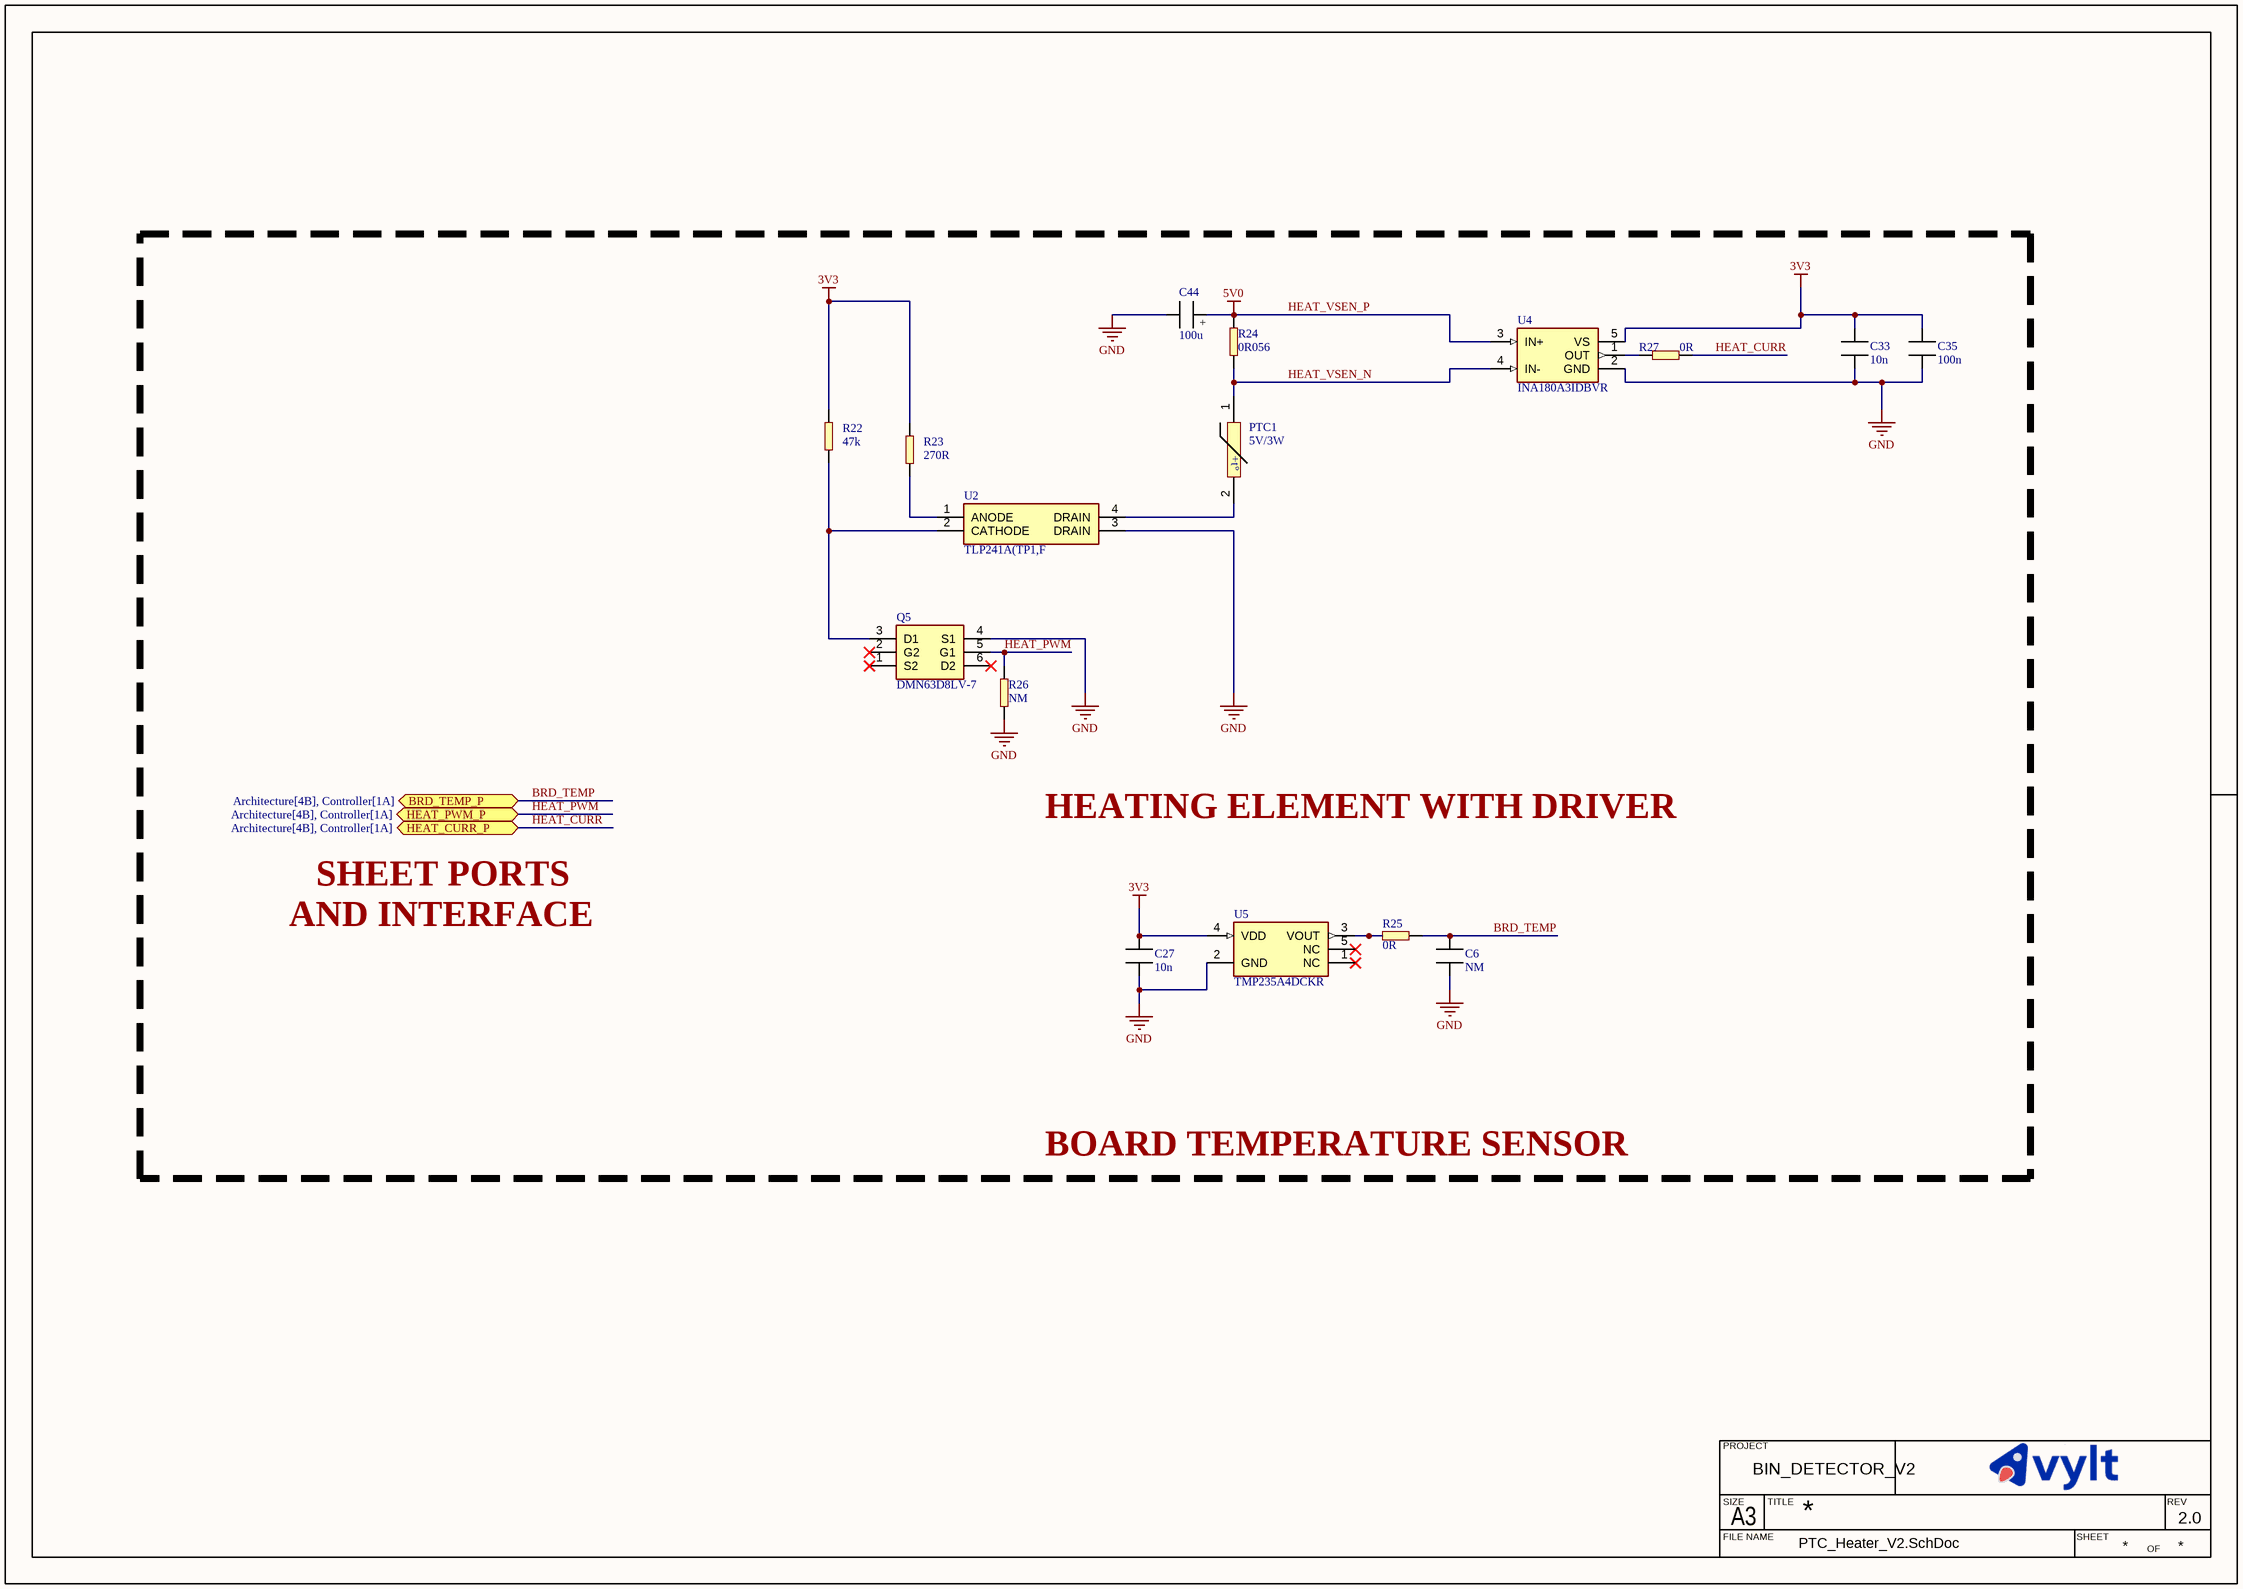
[diagram p5: PTC_Heater_V2.SchDoc]

### Parts
C6  value NM  [CAPC1608X10N]  (hidden comment: ERP_102-1)  (no BOM)
C27  value 10n  [CAPC1608X10N]  (hidden comment: ERP_102-1)
C33  value 10n  [CAPC1608X10N]  (hidden comment: ERP_102-1)
C35  value 100n  [CAPC1608X10N]  (hidden comment: ERP_102-1)
C44  value 100u  [CAP_6.3_7.7]  (hidden comment: ERP_102-2)
PTC1  value 5V/3W  [FIT0844]  (hidden comment: FIT0844)
Q5  value DMN63D8LV-7  [DMN63D8LV]  (hidden comment: DMN63D8LV)
R22  value 47k  [RES_0603]  (hidden comment: ERP_101-1)
R23  value 270R  [RES_0603]  (hidden comment: ERP_101-1)
R24  value 0R056  [RESC3115X06N]  (hidden comment: ERP_101-1)
R25  value 0R  [RES_0603]  (hidden comment: ERP_101-1)
R26  value NM  [RES_0603]  (hidden comment: ERP_101-1)  (no BOM)
R27  value 0R  [RES_0603]  (hidden comment: ERP_101-1)
U2  value TLP241A(TP1,F  [TLP241A]  (hidden comment: TLP241A)
U4  value INA180A3IDBVR  [INA180]  (hidden comment: INA180)
U5  value TMP235A4DCKR  [TMP235]  (hidden comment: TMP235)

### Ports
BRD_TEMP_P (bidir, see Architecture[4B], Controller[1A]), HEAT_CURR_P (bidir, see Architecture[4B], Controller[1A]), HEAT_PWM_P (bidir, see Architecture[4B], Controller[1A])

### Nets
3V3: C27.2 C33.2 C35.2 R22.2 R23.2 U4.5(VS) U5.4(VDD)
GND: C6.1 C27.1 C33.1 C35.1 C44.2 Q5.4(S1) R26.2 U2.3(DRAIN) U4.2(GND) U5.2(GND)
HEAT_VSEN_P: C44.1 R24.2 U4.3(IN+)  [also labelled 5V0]
BRD_TEMP: C6.2 R25.2 ; port BRD_TEMP_P
HEAT_CURR: R27.1 ; port HEAT_CURR_P
HEAT_PWM: Q5.5(G1) R26.1 ; port HEAT_PWM_P
HEAT_VSEN_N: PTC1.1 R24.1 U4.4(IN-)
NetPTC1_2: PTC1.2 U2.4(DRAIN)
NetQ5_3: Q5.3(D1) R22.1 U2.2(CATHODE)
NetR23_1: R23.1 U2.1(ANODE)
NetR25_1: R25.1 U5.3(VOUT)
NetR27_2: R27.2 U4.1(OUT)

Not connected (* = marked no-connect by the designer): Q5 1(S2)* 2(G2)* 6(D2)*; U5 1(NC)* 5(NC)*

### Notes on the sheet
- HEATING ELEMENT WITH DRIVER
- AND INTERFACE
- SHEET PORTS
- BOARD TEMPERATURE SENSOR
- PROJECT
- SIZE
- FILE NAME
- A3
- TITLE
- SHEET
- OF
- REV
- (in symbol CAP_6.3_7.7) +
- (in symbol FIT0844) +t°

### Library data of the parts
C6 = MLCC_0603: Chip Capacitor, 2-Leads, Body 1.60x0.80mm, IPC Medium Density; Package: 0603; Manufacturer 1: *; Manufacturer Part Number 1: *; Supplier 1: *; Suuplier Part Number 1: *; ERP: *
C27 = MLCC_0603: Manufacturer 1: Murata; Manufacturer Part Number 1: GRM1885C1H103JA01D; Package: 0603; Suuplier Part Number 1: *; ERP: *; Supplier 1: Digikey; Supplier Part Number 1: 490-9666-1-ND
C33 = MLCC_0603: Chip Capacitor, 2-Leads, Body 1.60x0.80mm, IPC Medium Density; Manufacturer 1: Murata; Manufacturer Part Number 1: GRM1885C1H103JA01D; Package: 0603; Suuplier Part Number 1: *; ERP: *; Supplier 1: Digikey; Supplier Part Number 1: 490-9666-1-ND
C35 = MLCC_0603: Chip Capacitor, 2-Leads, Body 1.60x0.80mm, IPC Medium Density; Manufacturer 1: Murata; Manufacturer Part Number 1: CC0603JRX7R9BB104; Package: 0603; Supplier 1: *; Suuplier Part Number 1: *; ERP: *
C44 = CAP_6.3_7.7: as C4 on sheet PowerSection_V2; Package: 6.3x7.7; ERP: *; Supplier 1: Digikey; Supplier Part Number 1: 493-2203-1-ND
PTC1 = FIT0844: PTC HEATER 5V 3W; Manufacturer 1: DFRobot; ERP: *; Supplier Part Number 1: *; Supplier 1: *; Package: Chassis Mount; Manufacturer Part Number 1: FIT0844
Q5 = DMN63D8LV: MOSFET 2N-CH 30V 0.26A SOT563; Manufacturer 1: Diodes Incorporated; ERP: *; Supplier Part Number 1: *; Supplier 1: *; Package: SOT563; Manufacturer Part Number 1: DMN63D8LV-7
R22 = RES_0603: Manufacturer 1: YAGEO; Manufacturer Part Number 1: RC0603FR-0747KL; Package: 0603; ERP: *; Supplier 1: *; Supplier Part Number 1: *; Supplier 2: Digikey; Supplier Part Number 2: 311-47.0KHRCT-ND
R23 = RES_0603: Manufacturer 1: YAGEO; Manufacturer Part Number 1: RC0603JR-07270RL; Package: 0603; ERP: *; Supplier 1: *; Supplier Part Number 1: *; Supplier 2: Digikey; Supplier Part Number 2: 311-270GRCT-ND
R24 = RES_1206: RES_0805; Manufacturer 1: TE Connectivity Passive Product; Manufacturer Part Number 1: RLC73PN2BR056FTD; Package: 1206; Supplier  1: *; Supplier  Part Number 1: *; ERP: *; Supplier 1: Digikey; Supplier Part Number 1: 1712-RLC73PN2BR056FTDCT-ND
R25 R27 = RES_0603: Manufacturer 1: YAGEO; Manufacturer Part Number 1: RC0603JR-070RL; Package: 0603; ERP: *; Supplier 1: Digikey; Supplier Part Number 1: 311-0.0GRCT-ND
R26 = RES_0603: Package: 0603; Manufacturer 1: *; Manufacturer Part Number 1: *; Supplier 1: *; Supplier Part Number 1: *; ERP: *
U2 = TLP241A: SSR RELAY SPST-NO 2A 0-40V; Manufacturer 1: Toshiba Semiconductor and Storage; ERP: *; Supplier Part Number 1: *; Supplier 1: *; Package: 4 Pin SMD; Manufacturer Part Number 1: TLP241A
U4 = INA180: Manufacturer 1: Texas Instruments; Manufacturer Part Number 1: INA180A3IDBVR; Package: SOT23-5; ERP: *; Supplier 1: *; Supplier Part Number 1: *; Supplier 2: Digikey; Supplier Part Number 2: 296-47654-1-ND
U5 = TMP235: Manufacturer 1: Texas Instruments; Manufacturer Part Number 1: TMP235A4DCKR; ERP: *; Package: SOT-353; Supplier 1: *; Supplier Part Number 1: *; Supplier 2: Digikey; Supplier Part Number 2: 296-50016-1-ND

## Nets that join several sheets
3V3: RFID_V2 (C31.1 C32.1 U1.16), Controller_V2 (J7.1 M3.2), Connectivity_V2 (J5.1), PowerSection_V2 (C3.1 C4.1 U3.2 U3.4), PTC_Heater_V2 (7 pins)
GND: RFID_V2 (35 pins), Controller_V2 (33 pins), Connectivity_V2 (M2.4 M4.4), PowerSection_V2 (16 pins), PTC_Heater_V2 (10 pins)
HEAT_VSEN_P: RFID_V2 (J1.1), PowerSection_V2 (C2.1 C30.1 D1.1 U3.3), PTC_Heater_V2 (C44.1 R24.2 U4.3)
BRD_TEMP: Controller_V2 (M1.13), PTC_Heater_V2 (C6.2 R25.2)
HEAT_CURR: Controller_V2 (M1.15), PTC_Heater_V2 (R27.1)
HEAT_PWM: Controller_V2 (M1.14), PTC_Heater_V2 (Q5.5 R26.1)
RFID_3V3_EN: RFID_V2 (R1.1), Controller_V2 (M1.18 M3.3)
RFID_3V3_IRQ: RFID_V2 (R21.1), Controller_V2 (M1.34)
RFID_MISO: RFID_V2 (R17.2), Controller_V2 (M1.32)
RFID_MOSI: RFID_V2 (R18.2), Controller_V2 (M1.31)
RFID_SCLK: RFID_V2 (R20.1), Controller_V2 (M1.30)
RFID_SS: RFID_V2 (R15.2), Controller_V2 (M1.19)
RS485_A_RX: Controller_V2 (M1.26), Connectivity_V2 (M2.3)
RS485_A_TX: Controller_V2 (M1.25), Connectivity_V2 (M2.2)
RS485_L1_N: Connectivity_V2 (M2.6), PowerSection_V2 (J6.7 R32.2)
RS485_L1_P: Connectivity_V2 (M2.7), PowerSection_V2 (J6.8 R31.2)
RS485_L2_N: Connectivity_V2 (M4.6), PowerSection_V2 (J9.7 R32.1)
RS485_L2_P: Connectivity_V2 (M4.7), PowerSection_V2 (J9.8 R31.1)